# EAGLE design Clamp board - 2S-7.4-0V rev C1 (EAGLE 7.2.0)
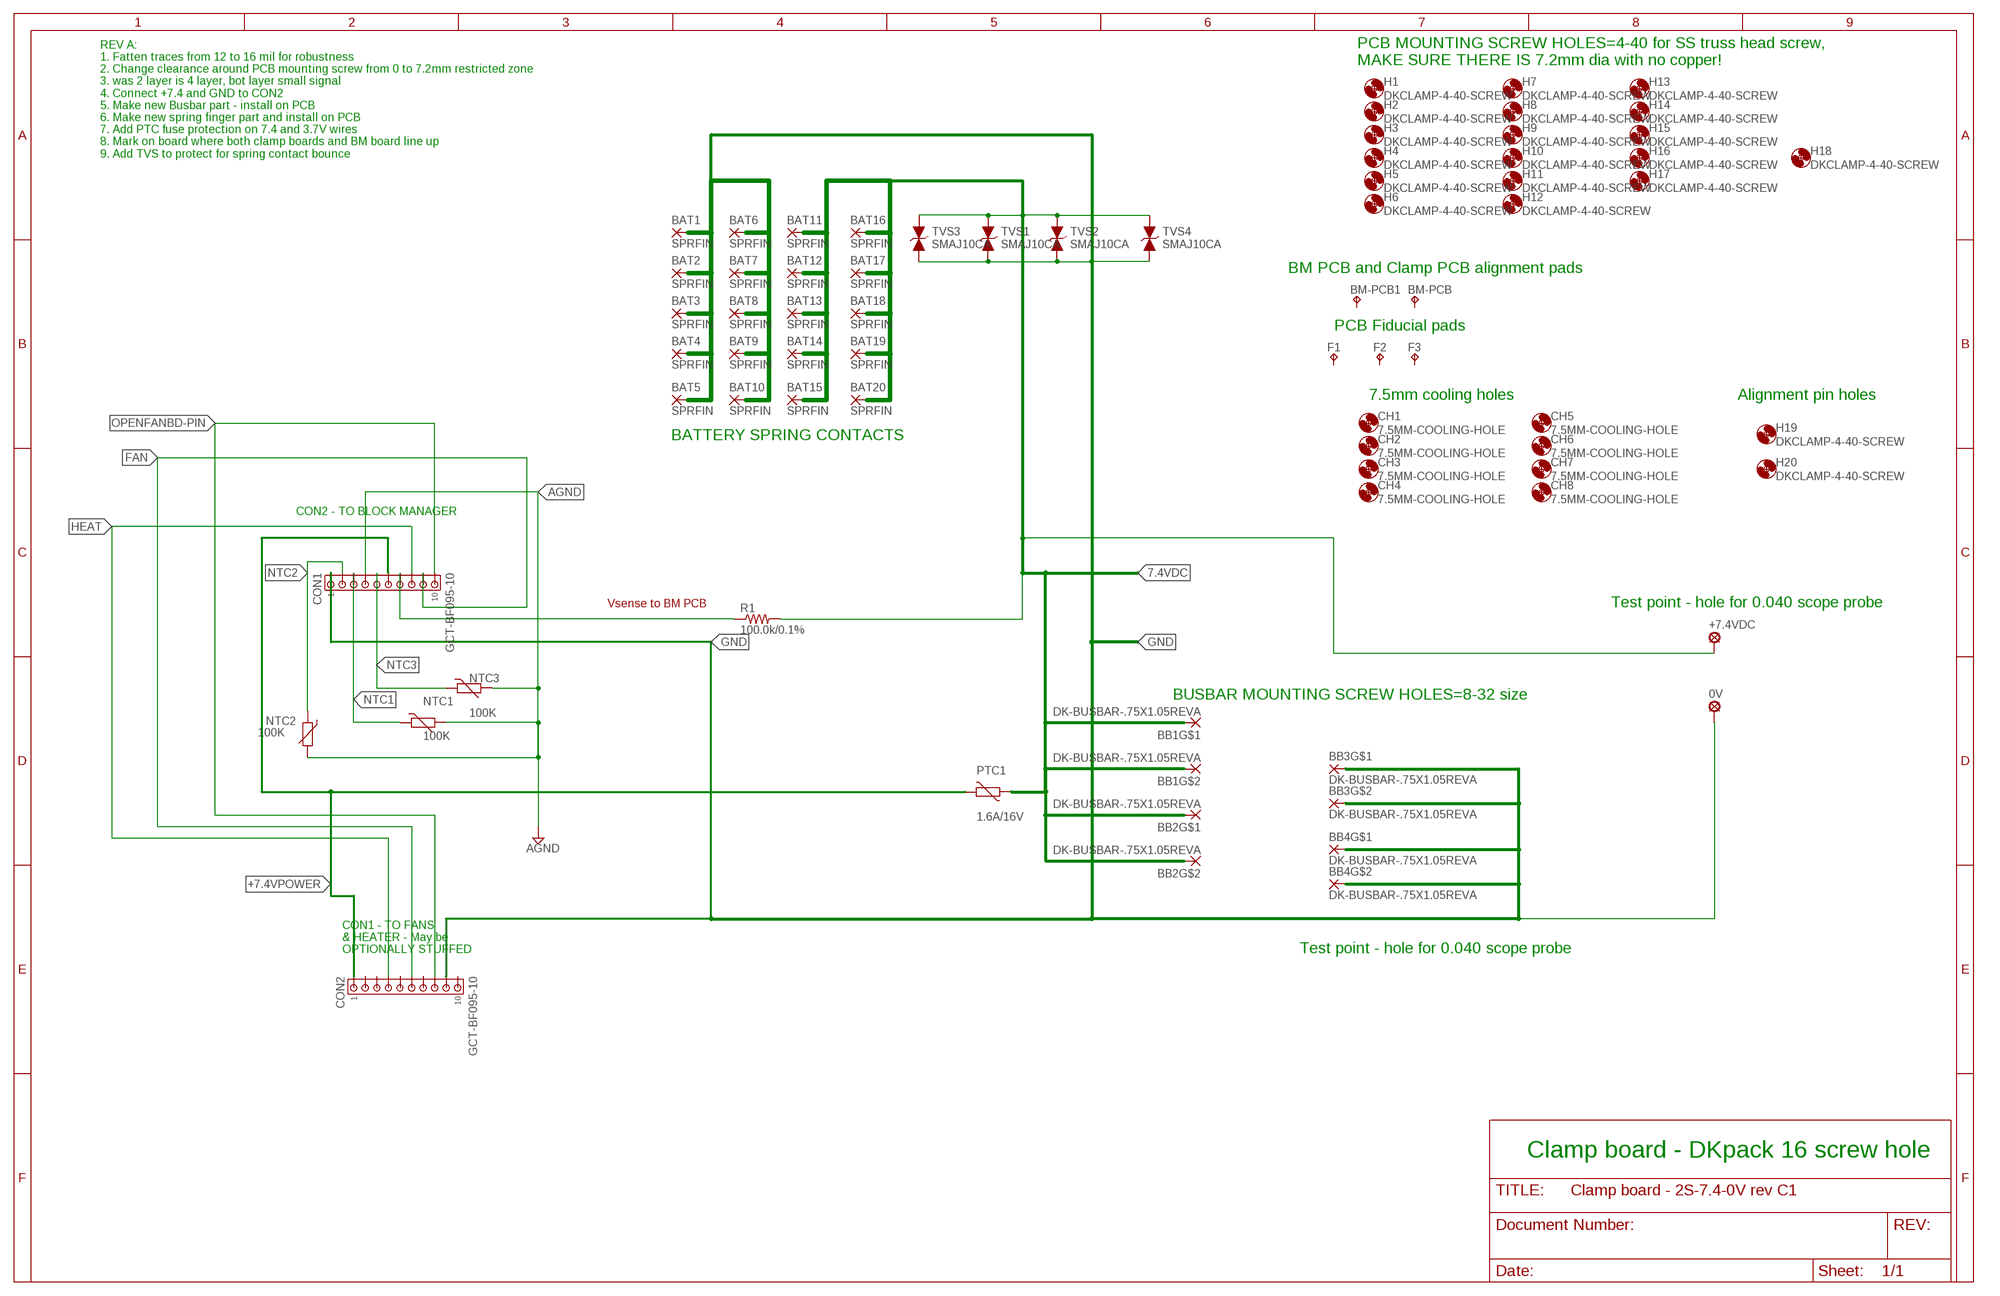
[diagram p0: schematic, sheet 1]

## Parts
0V  LSP10  [LSP10]
+7.4VDC  LSP10  [LSP10]
BAT1  SPRFIN  DK-SPRING-REV2  [DK-SPRING-FINGER-REV2]
BAT2  SPRFIN  DK-SPRING-REV2  [DK-SPRING-FINGER-REV2]
BAT3  SPRFIN  DK-SPRING-REV2  [DK-SPRING-FINGER-REV2]
BAT4  SPRFIN  DK-SPRING-REV2  [DK-SPRING-FINGER-REV2]
BAT5  SPRFIN  DK-SPRING-REV2  [DK-SPRING-FINGER-REV2]
BAT6  SPRFIN  DK-SPRING-REV2  [DK-SPRING-FINGER-REV2]
BAT7  SPRFIN  DK-SPRING-REV2  [DK-SPRING-FINGER-REV2]
BAT8  SPRFIN  DK-SPRING-REV2  [DK-SPRING-FINGER-REV2]
BAT9  SPRFIN  DK-SPRING-REV2  [DK-SPRING-FINGER-REV2]
BAT10  SPRFIN  DK-SPRING-REV2  [DK-SPRING-FINGER-REV2]
BAT11  SPRFIN  DK-SPRING-REV2  [DK-SPRING-FINGER-REV2]
BAT12  SPRFIN  DK-SPRING-REV2  [DK-SPRING-FINGER-REV2]
BAT13  SPRFIN  DK-SPRING-REV2  [DK-SPRING-FINGER-REV2]
BAT14  SPRFIN  DK-SPRING-REV2  [DK-SPRING-FINGER-REV2]
BAT15  SPRFIN  DK-SPRING-REV2  [DK-SPRING-FINGER-REV2]
BAT16  SPRFIN  DK-SPRING-REV2  [DK-SPRING-FINGER-REV2]
BAT17  SPRFIN  DK-SPRING-REV2  [DK-SPRING-FINGER-REV2]
BAT18  SPRFIN  DK-SPRING-REV2  [DK-SPRING-FINGER-REV2]
BAT19  SPRFIN  DK-SPRING-REV2  [DK-SPRING-FINGER-REV2]
BAT20  SPRFIN  DK-SPRING-REV2  [DK-SPRING-FINGER-REV2]
BB1  DK-BUSBAR-.75X1.05REVA  [DKBUSBAR]
BB2  DK-BUSBAR-.75X1.05REVA  [DKBUSBAR]
BB3  DK-BUSBAR-.75X1.05REVA  [DKBUSBAR]
BB4  DK-BUSBAR-.75X1.05REVA  [DKBUSBAR]
BM-PCB  FIDUCIALTP15SQ  [TP15SQ]
BM-PCB1  FIDUCIALTP15SQ  [TP15SQ]
CH1  7.5MM-COOLING-HOLE  [7.5MM-COOLING-HOLE]
CH2  7.5MM-COOLING-HOLE  [7.5MM-COOLING-HOLE]
CH3  7.5MM-COOLING-HOLE  [7.5MM-COOLING-HOLE]
CH4  7.5MM-COOLING-HOLE  [7.5MM-COOLING-HOLE]
CH5  7.5MM-COOLING-HOLE  [7.5MM-COOLING-HOLE]
CH6  7.5MM-COOLING-HOLE  [7.5MM-COOLING-HOLE]
CH7  7.5MM-COOLING-HOLE  [7.5MM-COOLING-HOLE]
CH8  7.5MM-COOLING-HOLE  [7.5MM-COOLING-HOLE]
CON1  GCT-BF095-10  [GCT-BF085-10]
CON2  GCT-BF095-10  [GCT-BF085-10]
F1  FIDUCIALB1,27  [B1,27]
F2  FIDUCIALB1,27  [B1,27]
F3  FIDUCIALB1,27  [B1,27]
H1  DKCLAMP-4-40-SCREW  [2.95MM-HOLE-FOR-4-40SCREW-DKCLAMP]
H2  DKCLAMP-4-40-SCREW  [2.95MM-HOLE-FOR-4-40SCREW-DKCLAMP]
H3  DKCLAMP-4-40-SCREW  [2.95MM-HOLE-FOR-4-40SCREW-DKCLAMP]
H4  DKCLAMP-4-40-SCREW  [2.95MM-HOLE-FOR-4-40SCREW-DKCLAMP]
H5  DKCLAMP-4-40-SCREW  [2.95MM-HOLE-FOR-4-40SCREW-DKCLAMP]
H6  DKCLAMP-4-40-SCREW  [2.95MM-HOLE-FOR-4-40SCREW-DKCLAMP]
H7  DKCLAMP-4-40-SCREW  [2.95MM-HOLE-FOR-4-40SCREW-DKCLAMP]
H8  DKCLAMP-4-40-SCREW  [2.95MM-HOLE-FOR-4-40SCREW-DKCLAMP]
H9  DKCLAMP-4-40-SCREW  [2.95MM-HOLE-FOR-4-40SCREW-DKCLAMP]
H10  DKCLAMP-4-40-SCREW  [2.95MM-HOLE-FOR-4-40SCREW-DKCLAMP]
H11  DKCLAMP-4-40-SCREW  [2.95MM-HOLE-FOR-4-40SCREW-DKCLAMP]
H12  DKCLAMP-4-40-SCREW  [2.95MM-HOLE-FOR-4-40SCREW-DKCLAMP]
H13  DKCLAMP-4-40-SCREW  [2.95MM-HOLE-FOR-4-40SCREW-DKCLAMP]
H14  DKCLAMP-4-40-SCREW  [2.95MM-HOLE-FOR-4-40SCREW-DKCLAMP]
H15  DKCLAMP-4-40-SCREW  [2.95MM-HOLE-FOR-4-40SCREW-DKCLAMP]
H16  DKCLAMP-4-40-SCREW  [2.95MM-HOLE-FOR-4-40SCREW-DKCLAMP]
H17  DKCLAMP-4-40-SCREW  [2.95MM-HOLE-FOR-4-40SCREW-DKCLAMP]
H18  DKCLAMP-4-40-SCREW  [2.95MM-HOLE-FOR-4-40SCREW-DKCLAMP]
H19  DKCLAMP-4-40-SCREW  [2.95MM-HOLE-FOR-4-40SCREW-DKCLAMP]
H20  DKCLAMP-4-40-SCREW  [2.95MM-HOLE-FOR-4-40SCREW-DKCLAMP]
NTC1  100K  NTC-MURATA-NCP18WF104J03RB  [0603]
NTC2  100K  NTC-MURATA-NCP18WF104J03RB  [0603]
NTC3  100K  NTC-MURATA-NCP18WF104J03RB  [0603]
PTC1  1.6A/16V  VARISTORCN1812  [CT/CN1812]
R1  100.0k/0.1%  R-US_R0603  [R0603]
TVS1  SMAJ10CA  TVS-SMA  [SMAJ]
TVS2  SMAJ10CA  TVS-SMA  [SMAJ]
TVS3  SMAJ10CA  TVS-SMA  [SMAJ]
TVS4  SMAJ10CA  TVS-SMA  [SMAJ]

## Nets
7.4VDC: +7.4VDC.MP BAT11.2(P) BAT12.2(P) BAT13.2(P) BAT14.2(P) BAT15.2(P) BAT16.2(P) BAT17.2(P) BAT18.2(P) BAT19.2(P) BAT20.2(P) BB1.P$2 BB1.P$3 BB2.P$2 BB2.P$3 PTC1.1 R1.2 TVS1.K(C) TVS2.K(C) TVS3.K(C) TVS4.K(C)
7.4VSCALED: CON1.P$7 R1.1
+7.4VPOWER: CON1.P$6 CON2.P$1 PTC1.2
AGND: CON1.P$4 NTC1.2 NTC2.2 NTC3.2
FAN: CON1.P$9 CON2.P$6
GND: 0V.MP BAT1.2(P) BAT2.2(P) BAT3.2(P) BAT4.2(P) BAT5.2(P) BAT6.2(P) BAT7.2(P) BAT8.2(P) BAT9.2(P) BAT10.2(P) BB3.P$2 BB3.P$3 BB4.P$2 BB4.P$3 CON1.P$1 CON2.P$9 TVS1.A TVS2.A TVS3.A TVS4.A
HEAT: CON1.P$8 CON2.P$4
NTC1: CON1.P$3 NTC1.1
NTC2: CON1.P$2 NTC2.1
NTC3: CON1.P$5 NTC3.1
OPENFANBD-PIN: CON1.P$10 CON2.P$8
Unconnected: BM-PCB1.TP BM-PCB.TP CON2.P$2 CON2.P$3 CON2.P$5 CON2.P$7 CON2.P$10 F1.PP(TP) F2.PP(TP) F3.PP(TP)

## Notes on the sheet
- PCB MOUNTING SCREW HOLES=4-40 for SS truss head screw,
  MAKE SURE THERE IS 7.2mm dia with no copper!
- REV A:
  1. Fatten traces from 12 to 16 mil for robustness
  2. Change clearance around PCB mounting screw from 0 to 7.2mm restricted zone
  3. was 2 layer is 4 layer, bot layer small signal
  4. Connect +7.4 and GND to CON2
  5. Make new Busbar part - install on PCB
  6. Make new spring finger part and install on PCB
  7. Add PTC fuse protection on 7.4 and 3.7V wires
  8. Mark on board where both clamp boards and BM board line up
  9. Add TVS to protect for spring contact bounce
- BM PCB and Clamp PCB alignment pads
- PCB Fiducial pads
- 7.5mm cooling holes | Alignment pin holes
- BATTERY SPRING CONTACTS
- CON2 - TO BLOCK MANAGER
- Vsense to BM PCB | Test point - hole for 0.040 scope probe
- BUSBAR MOUNTING SCREW HOLES=8-32 size
- CON1 - TO FANS
  & HEATER - May be 
  OPTIONALLY STUFFED
- Test point - hole for 0.040 scope probe
- Clamp board - DKpack 16 screw hole

## Library data of the parts
0V +7.4VDC = solpad:LSP10: SOLDER PAD drill 1.0 mm, distributor Buerklin, 12H555
BAT1 = Power_board - Copy:DK-SPRING-REV2; 100PCPRICE: .259; MPN: Keystone 109-2
BAT2-BAT20 = Power_board - Copy:DK-SPRING-REV2
BB1-BB4 = Power_board - Copy:DK-BUSBAR-.75X1.05REVA: DK copper busbar for connecting DK blocks, size is .75 in by 1.05 in by 1/8in thick. Takes two 8-32 brass screws into each DK block
BM-PCB BM-PCB1 F1-F3 = offgrid testpad:FIDUCIAL: Fiducial pad - B1,27
CH1-CH8 = offgrid holes:7.5MM-COOLING-HOLE: Cooling hole 7.5mm or .295in hole
CON1 CON2 = offgrid con-amp:GCT-BF095-10: GCT Bf095 series 2.00mm 2mm socket single row through hole vertical THP
H1-H20 = offgrid holes:DKCLAMP-4-40-SCREW: DKclamp screw hole of 2.95mm and keepout of .130rad or .260 head diameter Use 4-40 screw with truss head for clamp board
NTC1-NTC3 = offgrid varistor:NTC-MURATA-NCP18WF104J03RB: Murata NCP18WF104J03RB 100K NTC 5%; 100PCPRICE: .106; 1KPRICE: .07999; MPN: MURATA NCP18WF104J03RB
PTC1 = offgrid varistor:VARISTOR: VARISTOR; 100PCPRICE: .13; 1KPRICE: .09; MPN: Bel 0ZCG0160BF2C
R1 = offgrid resistor:R-US_: RESISTOR, American symbol
TVS1-TVS4 = offgrid diode:TVS-SMA: TVS diode in SMA package - bidirectional type - SMAJXXCA type; 100PCPRICE: .105; 1KPRICE: .081; MPN: ST SMAJ10CA-TR

## Board
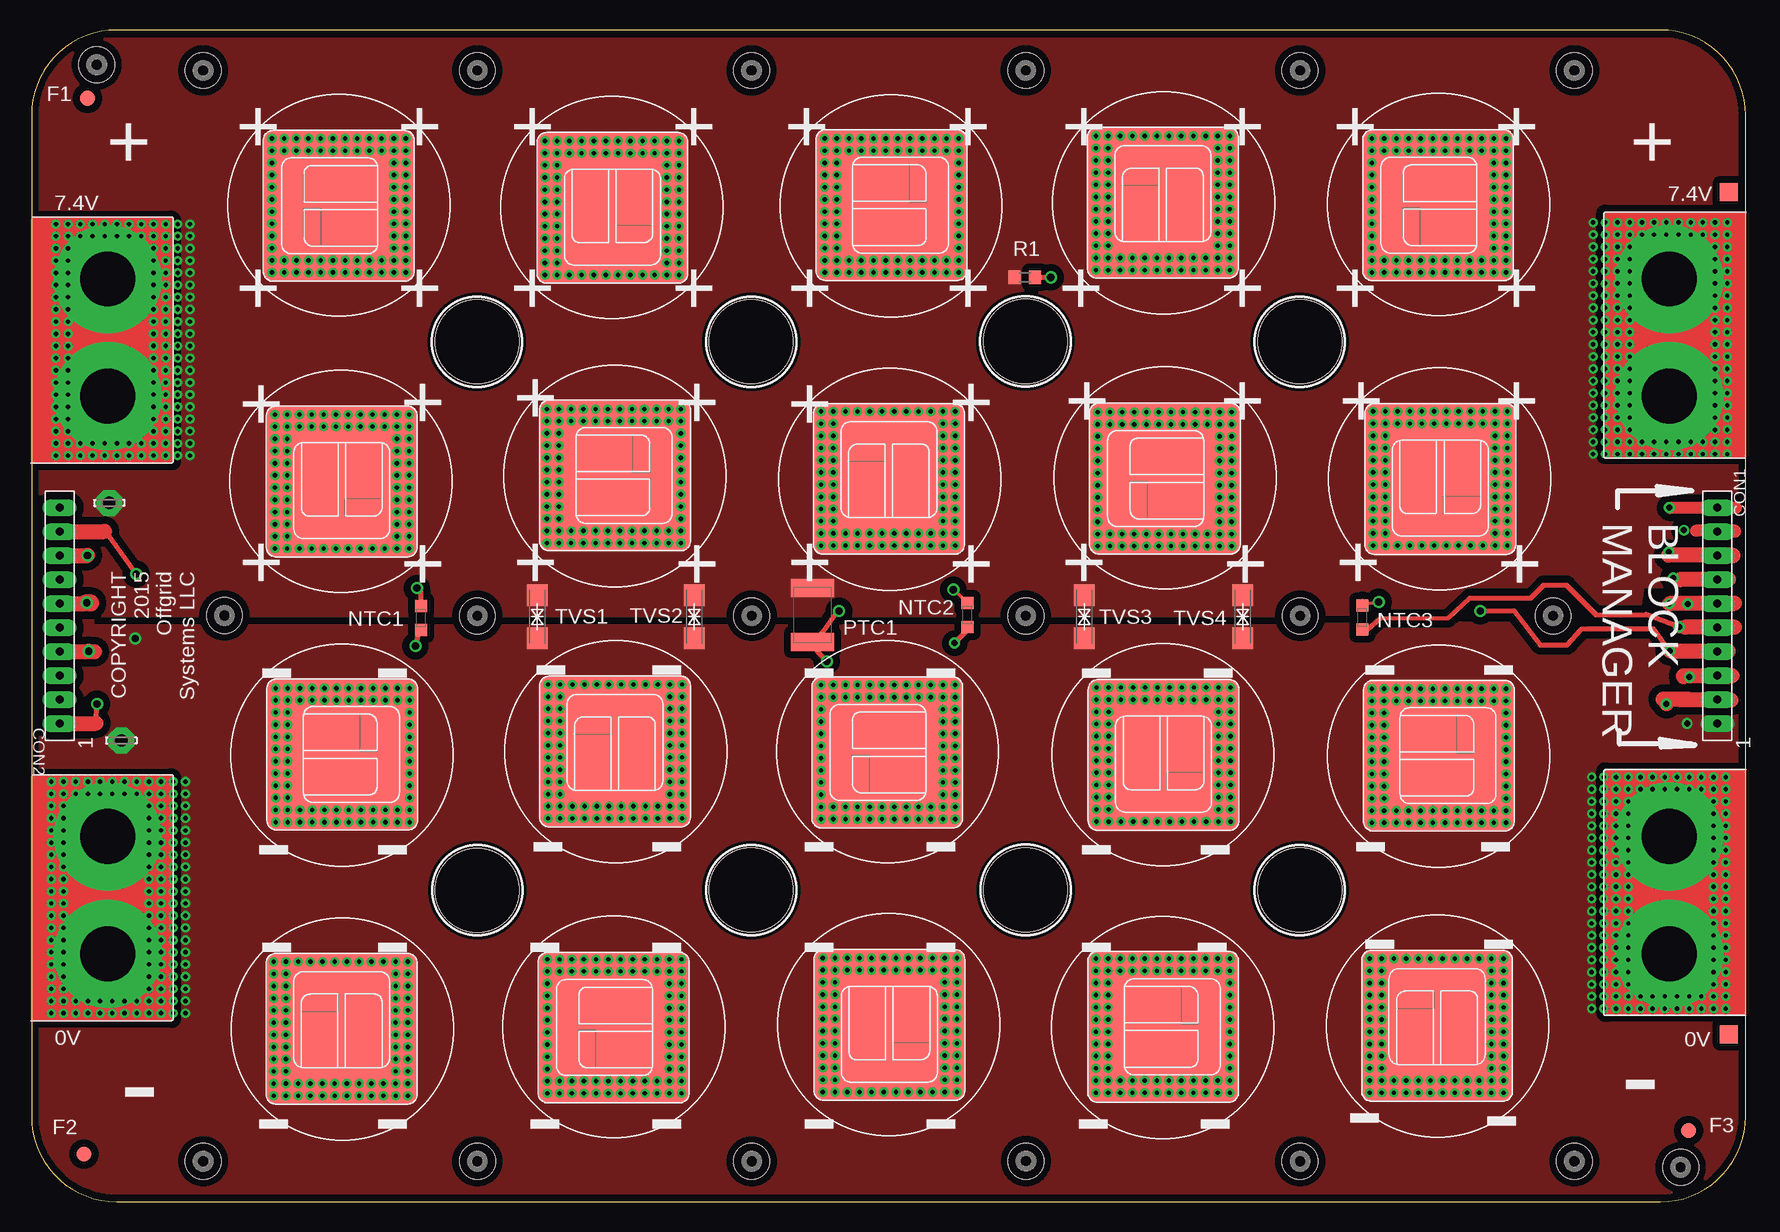
[diagram p1: board, top side]
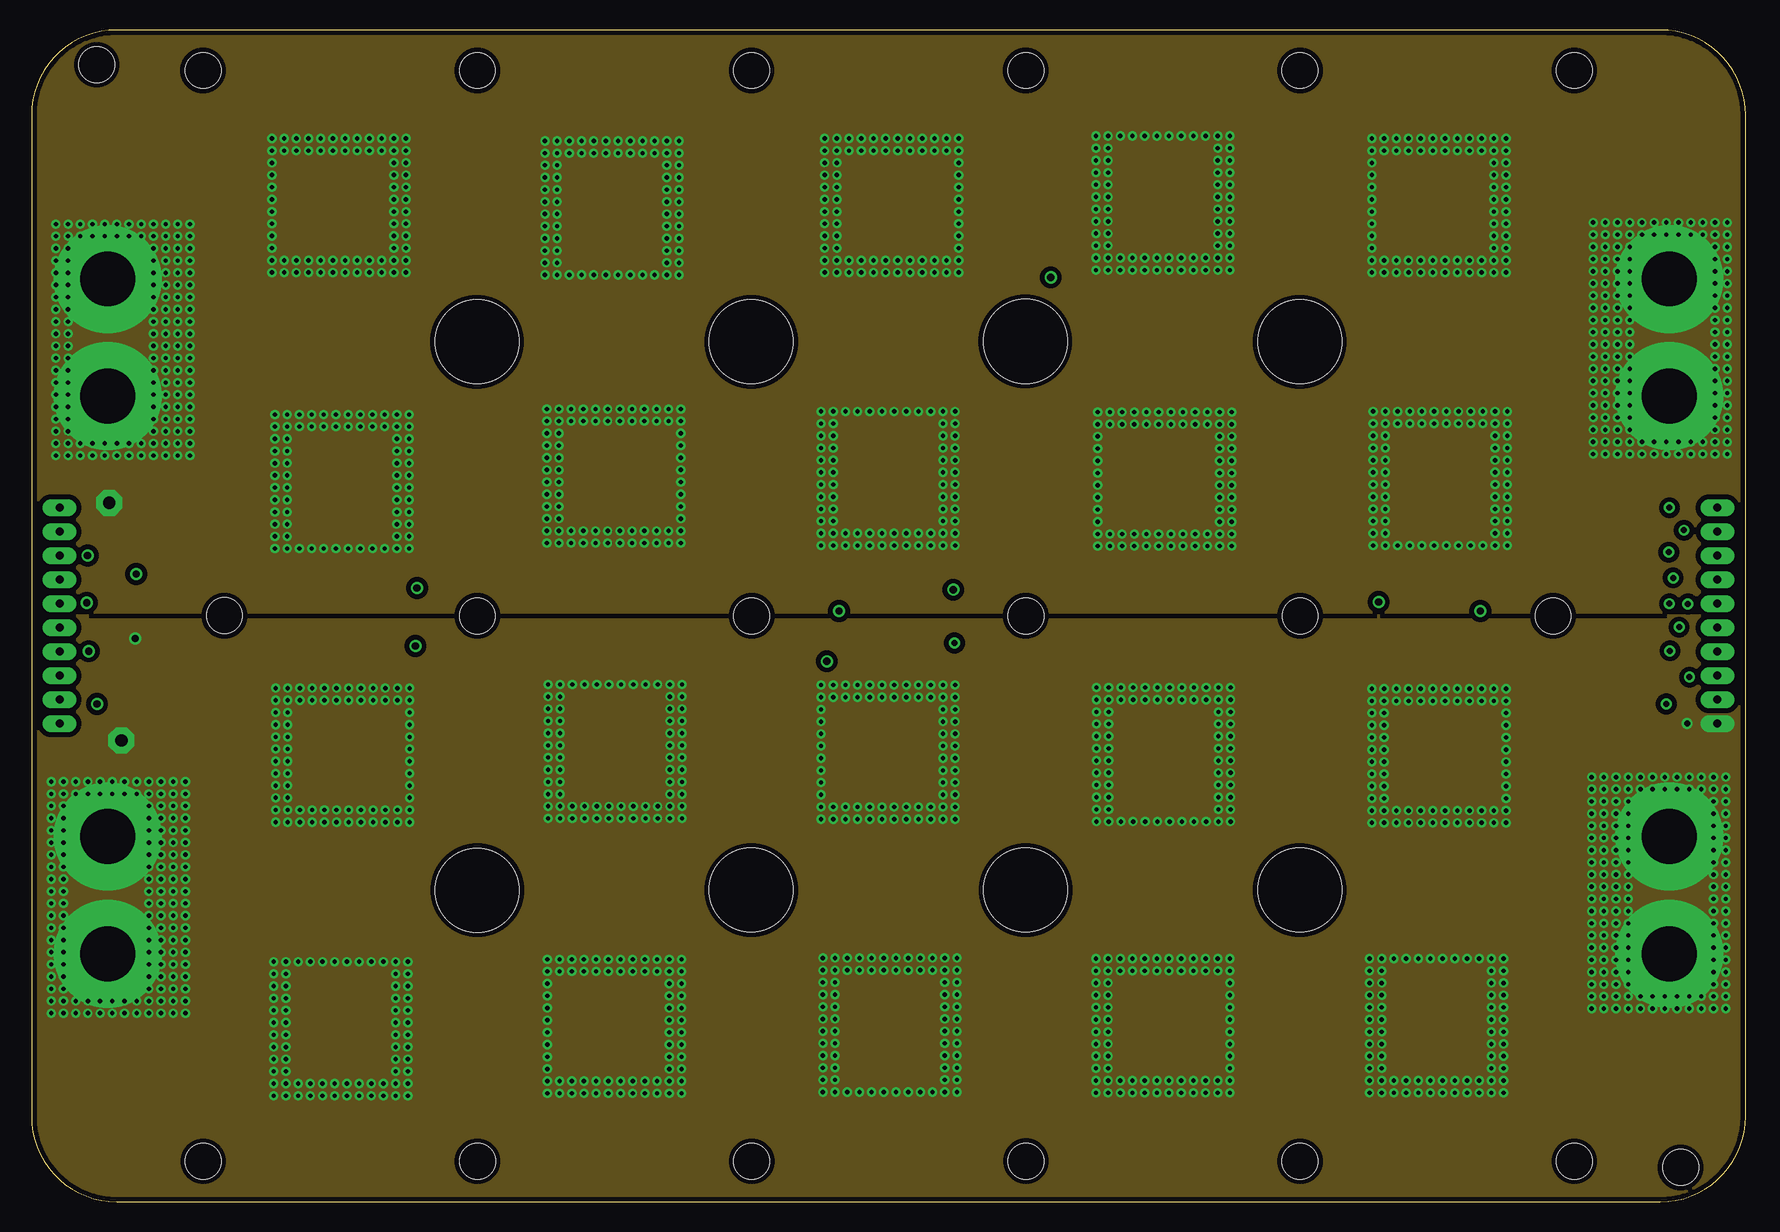
[diagram p2: board, inner layer InsideTop]
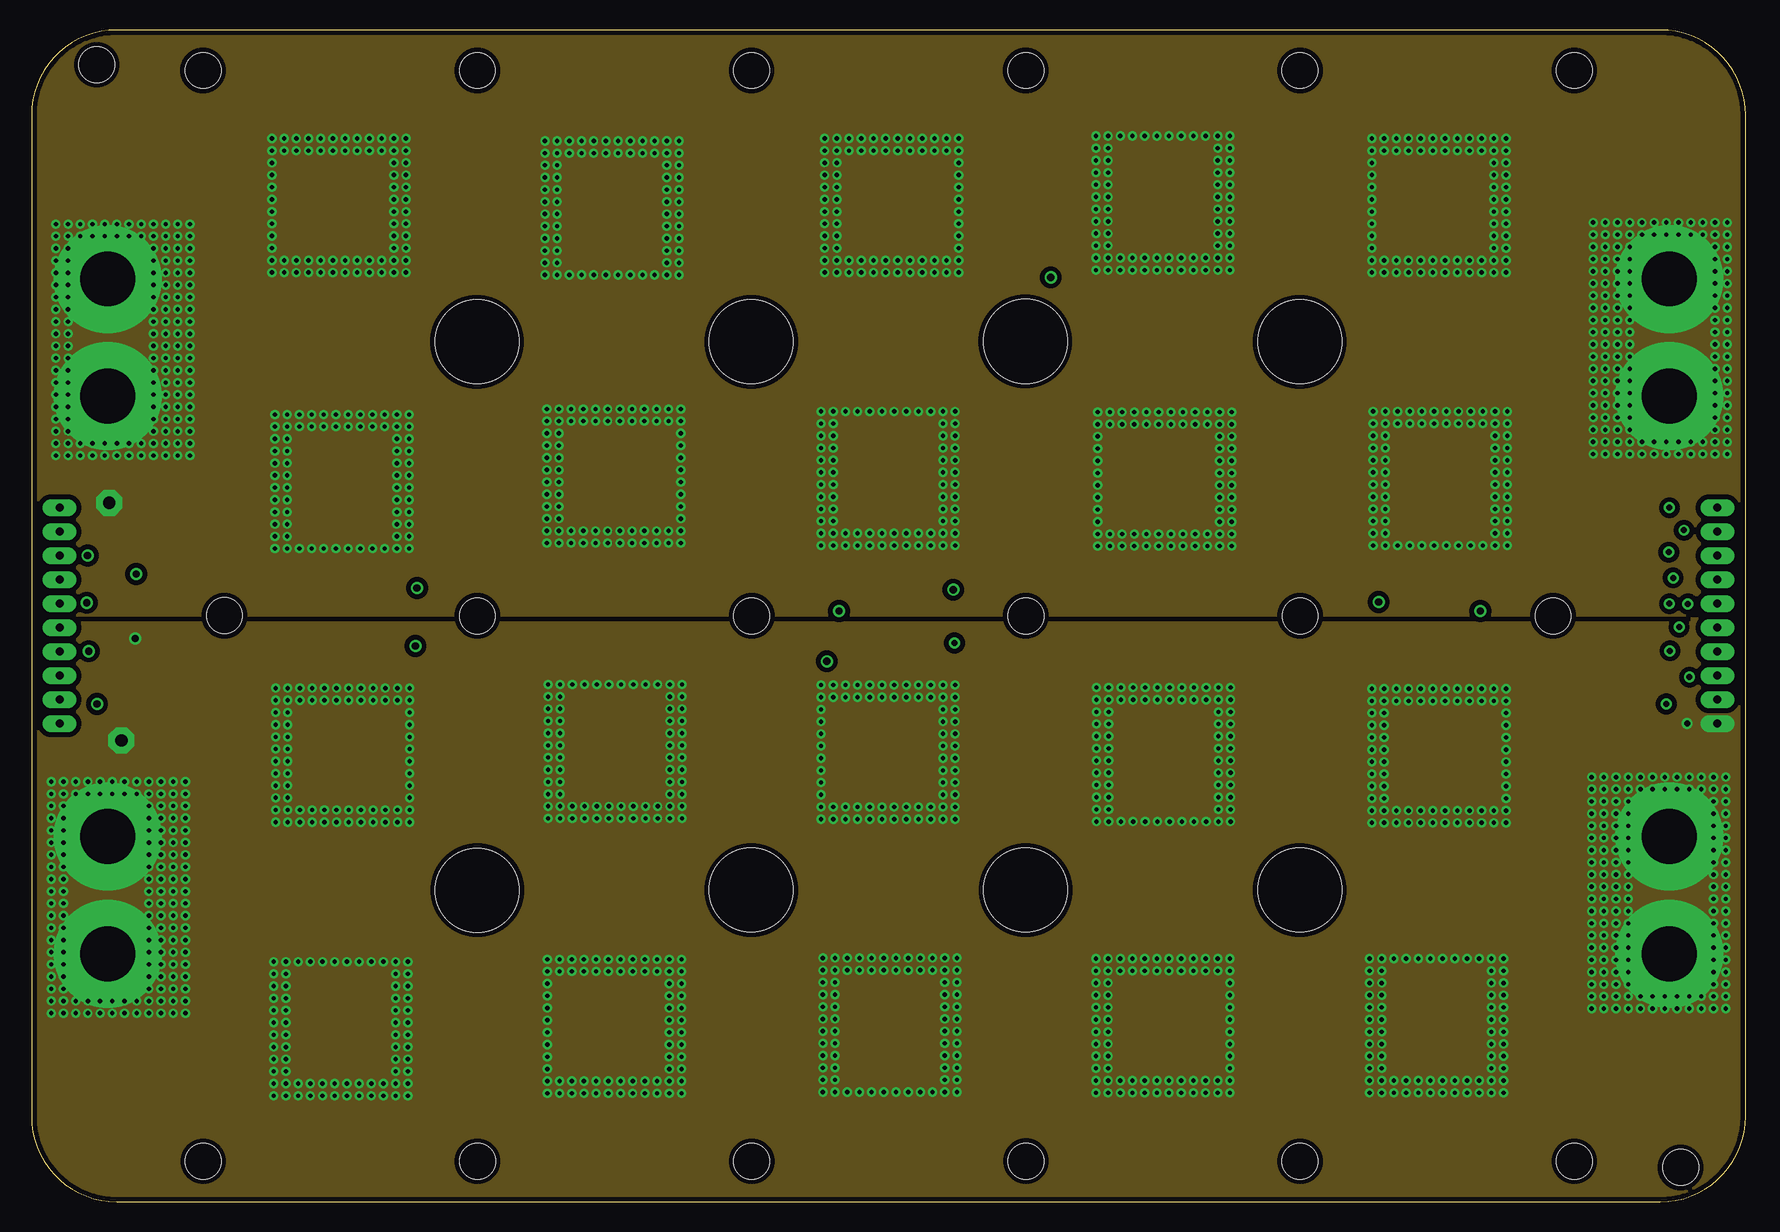
[diagram p3: board, inner layer InsideBot]
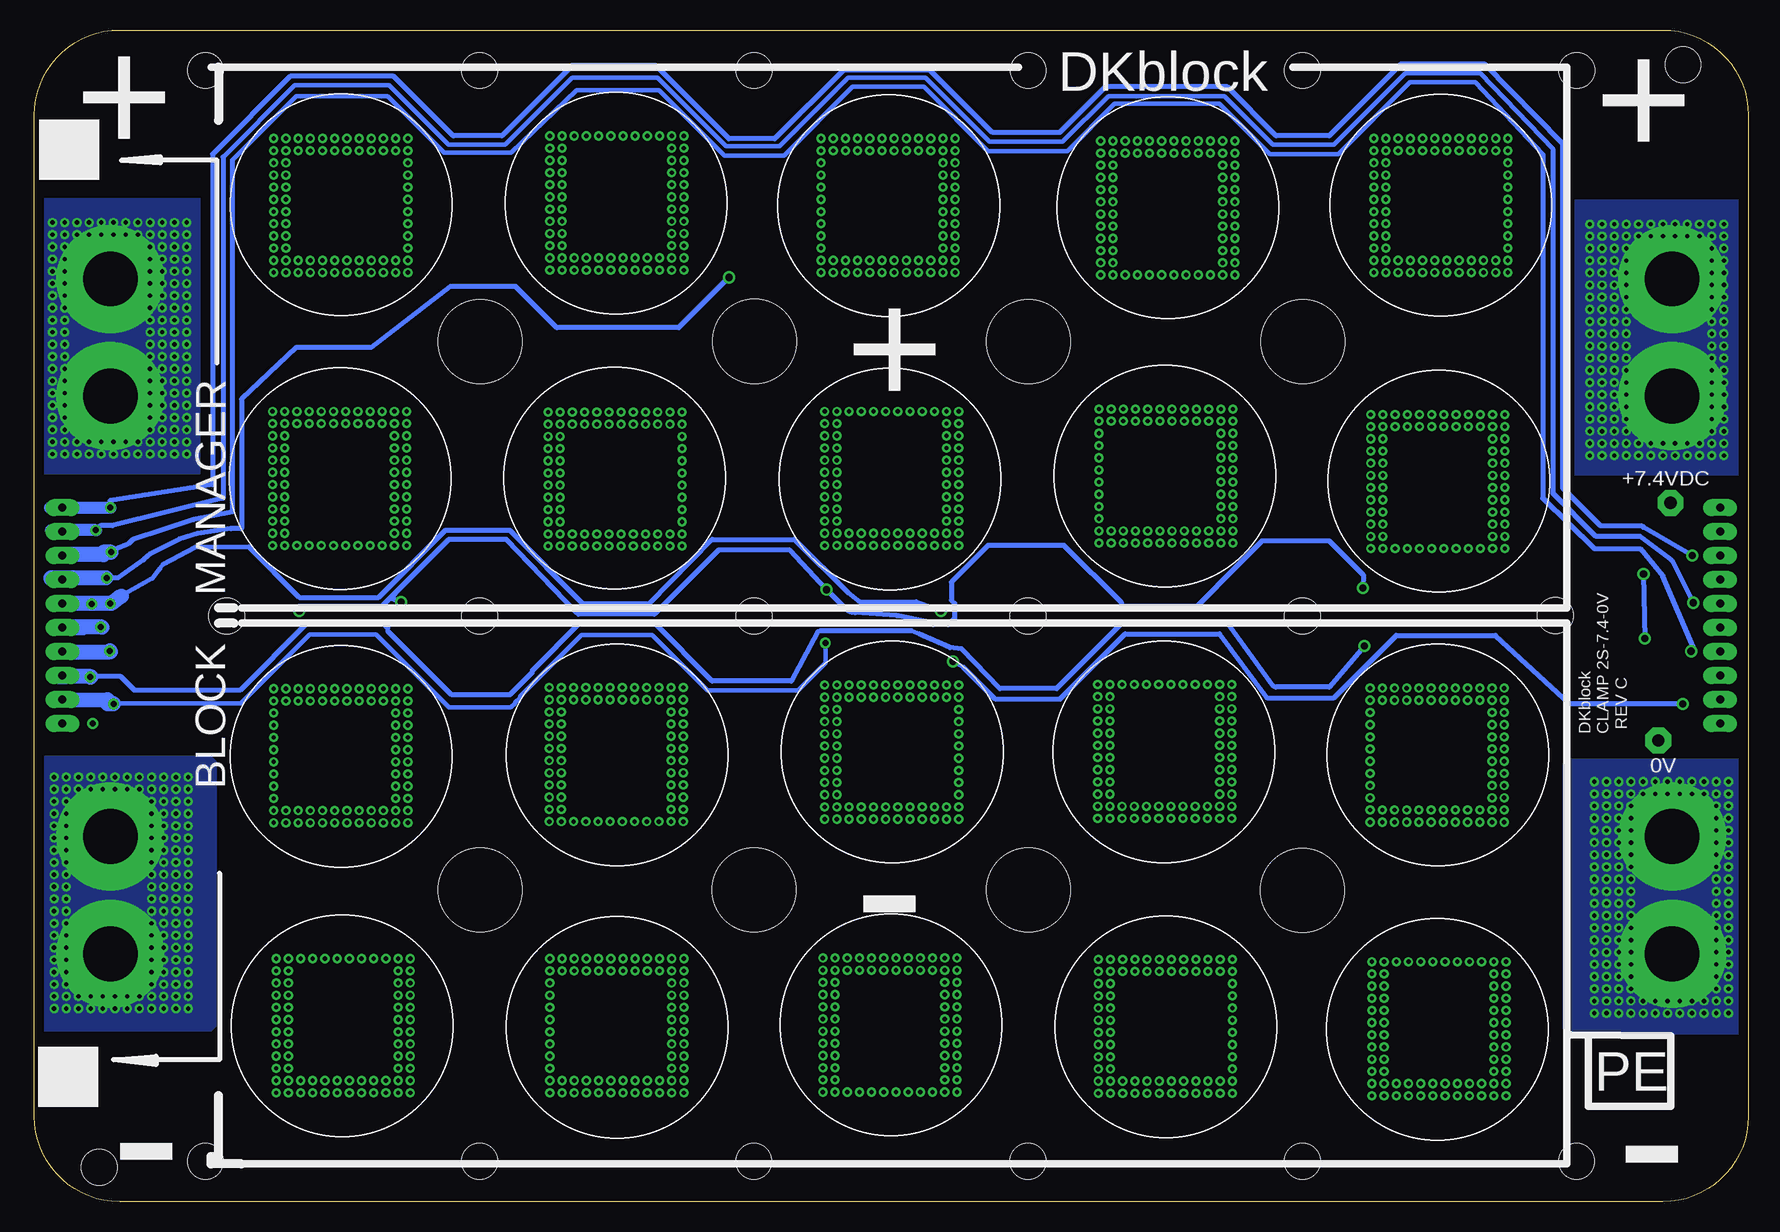
[diagram p4: board, bottom side, seen from below]

Size 142.88 x 97.69 mm. Coordinates in mm from the lower left corner, seen from the top.
Outline: 7.11,0 135.76,0 arc90 142.88,7.11 142.88,90.58 arc90 135.76,97.69 7.11,97.69 arc90 0,90.58 0,7.11 arc90 7.11,0
Copper layers ((1*2)+(3*16)): Top 0.035mm / dielectric 1.5mm / InsideTop 0.035mm / dielectric 0.15mm / InsideBot 0.035mm / dielectric 0.2mm / Bottom 0.035mm
Design rules "Offgrid design rules clamp boards 4 layer *": minimum track width 10mil, minimum drill 14mil, track to track 8mil, track to pad 8mil, pad to pad 8mil, via to via 8mil, smd to smd 0mil, copper to edge 10mil, drill to drill 5mil, minimum pad ring 10mil, minimum via ring 8mil, stop-mask expansion 4mil, vias tented up to drill 30mil, thermal gap 10mil

### Footprints (pad centres in the part's own frame; a part is rotated, then mirrored left to right if it is on the bottom)
LSP10 = drill 1.016 pad 2.159 octagon: MP 0,0
DK-SPRING-FINGER-REV2 = smd 12.573 x 12.573: 2 0,0.051
DKBUSBAR = drill 4.572 pad 9: P$2 1.397,-4.889; P$3 1.397,4.889
TP15SQ = smd 1.5 x 1.5: TP 0,0
7.5MM-COOLING-HOLE = hole 6.985: 0,0
GCT-BF085-10 = drill 0.66 pad 1.422 long: P$1 9,0; P$2 7,0; P$3 5,0; P$4 3,0; P$5 1,0; P$6 -1,0; P$7 -3,0; P$8 -5,0; P$9 -7,0; P$10 -9,0
B1,27 = smd 1.27 x 1.27: PP 0,0
2.95MM-HOLE-FOR-4-40SCREW-DKCLAMP = hole 2.972: 0,0
0603 = smd 1 x 1: 1 -1,0; 2 1,0
CT/CN1812 = smd 1.5 x 3.6: 1 -2.25,0; 2 2.25,0
R0603 = smd 1 x 1.1: 1 -0.85,0; 2 0.85,0
SMAJ = smd 1.8 x 1.7: A -1.898,0; K 1.694,0

### Placement (x,y rotation side)
0V  7.49,38.46 0 top
+7.4VDC  6.48,58.27 0 top
BAT1  117.29,37.13 0 top
BAT2  48.69,37.51 90 top
BAT3  94.31,37.27 270 top
BAT4  117.22,14.65 90 top
BAT5  71.45,14.76 270 top
BAT6  94.3,14.53 0 top
BAT7  48.55,14.58 180 top
BAT8  71.35,37.52 180 top
BAT9  25.91,14.4 90 top
BAT10  25.88,37.23 0 top
BAT11  48.61,60.5 0 top
BAT12  71.65,83.03 0 top
BAT13  25.8,60.08 270 top
BAT14  71.53,60.24 90 top
BAT15  48.36,82.89 270 top
BAT16  117.37,60.28 270 top
BAT17  94.49,60.35 180 top
BAT18  25.63,83.09 180 top
BAT19  117.28,83.14 180 top
BAT20  94.36,83.25 90 top
BB1  4.95,72.05 0 top
BB2  137.92,72.05 180 top
BB3  4.95,25.57 0 top
BB4  137.92,25.57 180 top
BM-PCB  141.48,84.18 0 top
BM-PCB1  141.48,13.94 0 top
CH1  37.12,71.7 0 top
CH2  59.99,71.7 0 top
CH3  82.85,71.73 0 top
CH4  105.71,71.7 0 top
CH5  37.15,25.98 0 top
CH6  59.99,25.99 0 top
CH7  82.86,25.99 0 top
CH8  105.71,25.99 0 top
CON1  140.53,48.87 270 top
CON2  2.35,48.87 270 top
F1  4.65,92 0 top
F2  4.38,3.97 0 top
F3  138.13,5.95 0 top
H1  14.31,94.31 0 top
H2  37.16,94.31 0 top
H3  60.02,94.31 0 top
H4  82.88,94.31 0 top
H5  105.74,94.31 0 top
H6  128.6,94.31 0 top
H7  37.16,48.84 0 top
H8  60.03,48.84 0 top
H9  82.88,48.84 0 top
H10  105.75,48.84 0 top
H11  14.31,3.38 0 top
H12  37.17,3.38 0 top
H13  60.03,3.38 0 top
H14  82.89,3.39 0 top
H15  105.74,3.38 0 top
H16  128.6,3.38 0 top
H17  16.08,48.87 0 top
H18  126.83,48.84 0 top
H19  5.44,94.79 0 top
H20  137.46,2.87 0 top
NTC1  32.46,48.67 90 top
NTC2  78,48.92 90 top
NTC3  110.92,48.72 90 top
PTC1  65.1,48.92 270 top
R1  82.8,77.06 180 top
TVS1  42.16,48.87 90 top
TVS2  55.24,48.87 90 top
TVS3  87.76,48.87 90 top
TVS4  100.97,48.87 90 top

### Tracks (layer width: path | path; a pad name or v marks a point on that pad's centre or on a via)
7.4VDC  (via drill 0.36)
  other vias: 31.22,77.47 30.2,77.47 29.18,77.47 28.17,77.47 27.15,77.47 26.14,77.47 25.12,77.47 24.1,77.47 23.09,77.47 22.07,77.47 21.06,77.47 20.04,77.47 20.04,78.49 20.04,79.5 20.04,80.52 20.04,81.53 20.04,82.55 20.04,83.57 20.04,84.58 20.04,85.6 20.04,86.61 20.04,87.63 20.04,88.65 31.22,78.49 30.2,78.49 29.18,78.49 28.17,78.49 27.15,78.49 26.14,78.49 25.12,78.49 24.1,78.49 23.09,78.49 22.07,78.49 21.06,78.49 31.22,79.5 30.2,79.5 31.22,80.52 30.2,80.52 31.22,81.53 30.2,81.53 30.2,82.55 31.22,83.57 30.2,83.57 31.22,84.58 30.2,84.58 31.22,85.6 30.2,85.6 31.22,86.61 30.2,86.61 30.2,87.63 31.22,87.63 31.22,88.65 30.2,88.65 29.18,88.65 29.18,87.63 28.17,87.63 27.15,87.63 26.14,87.63 25.12,87.63 24.1,87.63 23.09,87.63 22.07,87.63 21.06,87.63 21.06,88.65 22.07,88.65 23.09,88.65 24.1,88.65 25.12,88.65 26.14,88.65 27.15,88.65 28.17,88.65 31.22,82.55 53.98,88.44 53.98,87.43 53.98,86.41 53.98,85.39 53.98,84.38 53.98,83.36 53.98,82.35 53.98,81.33 53.98,80.31 53.98,79.3 53.98,78.28 53.98,77.27 52.96,77.27 51.94,77.27 50.93,77.27 49.91,77.27 48.9,77.27 47.88,77.27 46.86,77.27 45.85,77.27 44.83,77.27 43.82,77.27 42.8,77.27 52.96,88.44 52.96,87.43 52.96,86.41 52.96,85.39 52.96,84.38 52.96,83.36 52.96,82.35 52.96,81.33 52.96,80.31 52.96,79.3 52.96,78.28 51.94,88.44 51.94,87.43 50.93,88.44 50.93,87.43 49.91,88.44 49.91,87.43 48.9,87.43 47.88,88.44 47.88,87.43 46.86,88.44 46.86,87.43 45.85,88.44 45.85,87.43 44.83,88.44 44.83,87.43 43.82,87.43 43.82,88.44 42.8,88.44 42.8,87.43 42.8,86.41 43.82,86.41 43.82,85.39 43.82,84.38 43.82,83.36 43.82,82.35 43.82,81.33 43.82,80.31 43.82,79.3 43.82,78.28 42.8,78.28 42.8,79.3 42.8,80.31 42.8,81.33 42.8,82.35 42.8,83.36 42.8,84.38 42.8,85.39 48.9,88.44 66.12,88.65 67.13,88.65 68.15,88.65 69.16,88.65 70.18,88.65 71.2,88.65 72.21,88.65 73.23,88.65 74.24,88.65 75.26,88.65 76.28,88.65 77.29,88.65 77.29,87.63 77.29,86.61 77.29,85.6 77.29,84.58 77.29,83.57 77.29,82.55 77.29,81.53 77.29,80.52 77.29,79.5 77.29,78.49 77.29,77.47 66.12,87.63 67.13,87.63 68.15,87.63 69.16,87.63 70.18,87.63 71.2,87.63 72.21,87.63 73.23,87.63 74.24,87.63 75.26,87.63 76.28,87.63 66.12,86.61 67.13,86.61 66.12,85.6 67.13,85.6 66.12,84.58 67.13,84.58 67.13,83.57 66.12,82.55 67.13,82.55 66.12,81.53 67.13,81.53 66.12,80.52 67.13,80.52 66.12,79.5 67.13,79.5 67.13,78.49 66.12,78.49 66.12,77.47 67.13,77.47 68.15,77.47 68.15,78.49 69.16,78.49 70.18,78.49 71.2,78.49 72.21,78.49 73.23,78.49 74.24,78.49 75.26,78.49 76.28,78.49 76.28,77.47 75.26,77.47 74.24,77.47 73.23,77.47 72.21,77.47 71.2,77.47 70.18,77.47 69.16,77.47 66.12,83.57 88.72,77.67 88.72,78.69 88.72,79.71 88.72,80.72 88.72,81.74 88.72,82.75 88.72,83.77 88.72,84.79 88.72,85.8 88.72,86.82 88.72,87.83 88.72,88.85 89.74,88.85 90.75,88.85 91.77,88.85 92.79,88.85 93.8,88.85 94.82,88.85 95.83,88.85 96.85,88.85 97.87,88.85 98.88,88.85 99.9,88.85 89.74,77.67 89.74,78.69 89.74,79.71 89.74,80.72 89.74,81.74 89.74,82.75 89.74,83.77 89.74,84.79 89.74,85.8 89.74,86.82 89.74,87.83 90.75,77.67 90.75,78.69 91.77,77.67 91.77,78.69 92.79,77.67 92.79,78.69 93.8,78.69 94.82,77.67 94.82,78.69 95.83,77.67 95.83,78.69 96.85,77.67 96.85,78.69 97.87,77.67 97.87,78.69 98.88,78.69 98.88,77.67 99.9,77.67 99.9,78.69 99.9,79.71 98.88,79.71 98.88,80.72 98.88,81.74 98.88,82.75 98.88,83.77 98.88,84.79 98.88,85.8 98.88,86.82 98.88,87.83 99.9,87.83 99.9,86.82 99.9,85.8 99.9,84.79 99.9,83.77 99.9,82.75 99.9,81.74 99.9,80.72 93.8,77.67 123.01,65.89 123.01,64.87 123.01,63.86 123.01,62.84 123.01,61.82 123.01,60.81 123.01,59.79 123.01,58.78 123.01,57.76 123.01,56.74 123.01,55.73 123.01,54.71 122,54.71 120.98,54.71 119.96,54.71 118.95,54.71 117.93,54.71 116.92,54.71 115.9,54.71 114.88,54.71 113.87,54.71 112.85,54.71 111.84,54.71 122,65.89 122,64.87 122,63.86 122,62.84 122,61.82 122,60.81 122,59.79 122,58.78 122,57.76 122,56.74 122,55.73 120.98,65.89 120.98,64.87 119.96,65.89 119.96,64.87 118.95,65.89 118.95,64.87 117.93,64.87 116.92,65.89 116.92,64.87 115.9,65.89 115.9,64.87 114.88,65.89 114.88,64.87 113.87,65.89 113.87,64.87 112.85,64.87 112.85,65.89 111.84,65.89 111.84,64.87 111.84,63.86 112.85,63.86 112.85,62.84 112.85,61.82 112.85,60.81 112.85,59.79 112.85,58.78 112.85,57.76 112.85,56.74 112.85,55.73 111.84,55.73 111.84,56.74 111.84,57.76 111.84,58.78 111.84,59.79 111.84,60.81 111.84,61.82 111.84,62.84 117.93,65.89 65.81,54.71 65.81,55.73 65.81,56.74 65.81,57.76 65.81,58.78 65.81,59.79 65.81,60.81 65.81,61.82 65.81,62.84 65.81,63.86 65.81,64.87 65.81,65.89 66.83,65.89 67.84,65.89 68.86,65.89 69.88,65.89 70.89,65.89 71.91,65.89 72.92,65.89 73.94,65.89 74.96,65.89 75.97,65.89 76.99,65.89 66.83,54.71 66.83,55.73 66.83,56.74 66.83,57.76 66.83,58.78 66.83,59.79 66.83,60.81 66.83,61.82 66.83,62.84 66.83,63.86 66.83,64.87 67.84,54.71 67.84,55.73 68.86,54.71 68.86,55.73 69.88,54.71 69.88,55.73 70.89,55.73 71.91,54.71 71.91,55.73 72.92,54.71 72.92,55.73 73.94,54.71 73.94,55.73 74.96,54.71 74.96,55.73 75.97,55.73 75.97,54.71 76.99,54.71 76.99,55.73 76.99,56.74 75.97,56.74 75.97,57.76 75.97,58.78 75.97,59.79 75.97,60.81 75.97,61.82 75.97,62.84 75.97,63.86 75.97,64.87 76.99,64.87 76.99,63.86 76.99,62.84 76.99,61.82 76.99,60.81 76.99,59.79 76.99,58.78 76.99,57.76 70.89,54.71 100.05,54.66 99.03,54.66 98.02,54.66 97,54.66 95.99,54.66 94.97,54.66 93.95,54.66 92.94,54.66 91.92,54.66 90.91,54.66 89.89,54.66 88.87,54.66 88.87,55.68 88.87,56.69 88.87,57.71 88.87,58.72 88.87,59.74 88.87,60.76 88.87,61.77 88.87,62.79 88.87,63.8 88.87,64.82 88.87,65.84 100.05,55.68 99.03,55.68 98.02,55.68 97,55.68 95.99,55.68 94.97,55.68 93.95,55.68 92.94,55.68 91.92,55.68 90.91,55.68 89.89,55.68 100.05,56.69 99.03,56.69 100.05,57.71 99.03,57.71 100.05,58.72 99.03,58.72 99.03,59.74 100.05,60.76 99.03,60.76 100.05,61.77 99.03,61.77 100.05,62.79 99.03,62.79 100.05,63.8 99.03,63.8 99.03,64.82 100.05,64.82 100.05,65.84 99.03,65.84 98.02,65.84 98.02,64.82 97,64.82 95.99,64.82 94.97,64.82 93.95,64.82 92.94,64.82 91.92,64.82 90.91,64.82 89.89,64.82 89.89,65.84 90.91,65.84 91.92,65.84 92.94,65.84 93.95,65.84 94.97,65.84 95.99,65.84 97,65.84 100.05,59.74 122.91,77.47 121.89,77.47 120.88,77.47 119.86,77.47 118.85,77.47 117.83,77.47 116.81,77.47 115.8,77.47 114.78,77.47 113.77,77.47 112.75,77.47 111.73,77.47 111.73,78.49 111.73,79.5 111.73,80.52 111.73,81.53 111.73,82.55 111.73,83.57 111.73,84.58 111.73,85.6 111.73,86.61 111.73,87.63 111.73,88.65 122.91,78.49 121.89,78.49 120.88,78.49 119.86,78.49 118.85,78.49 117.83,78.49 116.81,78.49 115.8,78.49 114.78,78.49 113.77,78.49 112.75,78.49 122.91,79.5 121.89,79.5 122.91,80.52 121.89,80.52 122.91,81.53 121.89,81.53 121.89,82.55 122.91,83.57 121.89,83.57 122.91,84.58 121.89,84.58 122.91,85.6 121.89,85.6 122.91,86.61 121.89,86.61 121.89,87.63 122.91,87.63 122.91,88.65 121.89,88.65 120.88,88.65 120.88,87.63 119.86,87.63 118.85,87.63 117.83,87.63 116.81,87.63 115.8,87.63 114.78,87.63 113.77,87.63 112.75,87.63 112.75,88.65 113.77,88.65 114.78,88.65 115.8,88.65 116.81,88.65 117.83,88.65 118.85,88.65 119.86,88.65 122.91,82.55 42.95,66.09 43.97,66.09 44.98,66.09 46,66.09 47.02,66.09 48.03,66.09 49.05,66.09 50.06,66.09 51.08,66.09 52.1,66.09 53.11,66.09 54.13,66.09 54.13,65.07 54.13,64.06 54.13,63.04 54.13,62.03 54.13,61.01 54.13,59.99 54.13,58.98 54.13,57.96 54.13,56.95 54.13,55.93 54.13,54.91 42.95,65.07 43.97,65.07 44.98,65.07 46,65.07 47.02,65.07 48.03,65.07 49.05,65.07 50.06,65.07 51.08,65.07 52.1,65.07 53.11,65.07 42.95,64.06 43.97,64.06 42.95,63.04 43.97,63.04 42.95,62.03 43.97,62.03 43.97,61.01 42.95,59.99 43.97,59.99 42.95,58.98 43.97,58.98 42.95,57.96 43.97,57.96 42.95,56.95 43.97,56.95 43.97,55.93 42.95,55.93 42.95,54.91 43.97,54.91 44.98,54.91 44.98,55.93 46,55.93 47.02,55.93 48.03,55.93 49.05,55.93 50.06,55.93 51.08,55.93 52.1,55.93 53.11,55.93 53.11,54.91 52.1,54.91 51.08,54.91 50.06,54.91 49.05,54.91 48.03,54.91 47.02,54.91 46,54.91 42.95,61.01 31.47,65.63 31.47,64.62 31.47,63.6 31.47,62.59 31.47,61.57 31.47,60.55 31.47,59.54 31.47,58.52 31.47,57.51 31.47,56.49 31.47,55.47 31.47,54.46 30.45,54.46 29.44,54.46 28.42,54.46 27.41,54.46 26.39,54.46 25.37,54.46 24.36,54.46 23.34,54.46 22.33,54.46 21.31,54.46 20.29,54.46 30.45,65.63 30.45,64.62 30.45,63.6 30.45,62.59 30.45,61.57 30.45,60.55 30.45,59.54 30.45,58.52 30.45,57.51 30.45,56.49 30.45,55.47 29.44,65.63 29.44,64.62 28.42,65.63 28.42,64.62 27.41,65.63 27.41,64.62 26.39,64.62 25.37,65.63 25.37,64.62 24.36,65.63 24.36,64.62 23.34,65.63 23.34,64.62 22.33,65.63 22.33,64.62 21.31,64.62 21.31,65.63 20.29,65.63 20.29,64.62 20.29,63.6 21.31,63.6 21.31,62.59 21.31,61.57 21.31,60.55 21.31,59.54 21.31,58.52 21.31,57.51 21.31,56.49 21.31,55.47 20.29,55.47 20.29,56.49 20.29,57.51 20.29,58.52 20.29,59.54 20.29,60.55 20.29,61.57 20.29,62.59 26.39,65.63 130.18,81.64 130.18,80.62 131.19,80.62 131.19,81.64 131.19,79.6 130.18,79.6 130.18,77.57 130.18,78.59 130.18,76.56 130.18,75.54 130.18,74.52 130.18,62.33 130.18,63.35 130.18,64.36 130.18,65.38 130.18,66.4 130.18,67.41 130.18,68.43 130.18,69.44 130.18,70.46 130.18,71.48 130.18,72.49 130.18,73.51 132.21,81.64 133.22,81.64 134.24,81.64 135.25,81.64 136.27,81.64 137.29,81.64 138.3,81.64 139.32,81.64 140.34,81.64 141.35,81.64 141.35,80.62 140.34,80.62 139.32,80.62 138.3,80.62 137.29,80.62 136.27,80.62 135.25,80.62 134.24,80.62 133.22,80.62 132.21,80.62 132.21,79.6 141.35,79.6 141.35,78.59 141.35,77.57 141.35,76.56 141.35,75.54 141.35,74.52 141.35,73.51 141.35,72.49 141.35,71.48 141.35,70.46 141.35,69.44 141.35,68.43 141.35,67.41 141.35,66.4 141.35,65.38 141.35,64.36 141.35,63.35 141.35,62.33 140.34,62.33 139.32,62.33 138.3,62.33 137.29,62.33 136.27,62.33 135.25,62.33 134.24,62.33 133.22,62.33 132.21,62.33 131.19,62.33 131.19,63.35 131.19,64.36 131.19,65.38 131.19,66.4 131.19,67.41 131.19,68.43 131.19,69.44 131.19,70.46 131.19,71.48 131.19,72.49 131.19,73.51 131.19,74.52 131.19,75.54 131.19,76.56 131.19,77.57 131.19,78.59 132.21,78.59 132.21,77.57 132.21,76.56 132.21,75.54 132.21,74.52 132.21,73.51 132.21,72.49 132.21,71.48 132.21,70.46 132.21,69.44 132.21,68.43 132.21,67.41 132.21,66.4 132.21,65.38 132.21,64.36 132.21,63.35 133.22,63.35 134.24,63.35 135.25,63.35 136.27,63.35 137.29,63.35 138.3,63.35 139.32,63.35 140.34,63.35 133.22,64.36 133.22,65.38 133.22,66.4 133.22,67.41 133.22,68.43 133.22,69.44 133.22,70.46 133.22,71.48 133.22,72.49 133.22,73.51 133.22,74.52 133.22,75.54 133.22,76.56 133.22,77.57 133.22,78.59 133.22,79.6 140.34,79.6 140.34,78.59 140.34,77.57 140.34,76.56 140.34,75.54 140.34,74.52 140.34,73.51 140.34,72.49 140.34,71.48 140.34,70.46 140.34,69.44 140.34,68.43 140.34,67.41 140.34,66.4 140.34,65.38 140.34,64.36 13.21,62.2 13.21,63.22 12.19,63.22 12.19,62.2 12.19,64.24 13.21,64.24 13.21,66.27 13.21,65.25 13.21,67.28 13.21,68.3 13.21,69.32 13.21,81.51 13.21,80.49 13.21,79.48 13.21,78.46 13.21,77.44 13.21,76.43 13.21,75.41 13.21,74.4 13.21,73.38 13.21,72.36 13.21,71.35 13.21,70.33 11.18,62.2 10.16,62.2 9.14,62.2 8.13,62.2 7.11,62.2 6.1,62.2 5.08,62.2 4.06,62.2 3.05,62.2 2.03,62.2 2.03,63.22 3.05,63.22 4.06,63.22 5.08,63.22 6.1,63.22 7.11,63.22 8.13,63.22 9.14,63.22 10.16,63.22 11.18,63.22 11.18,64.24 2.03,64.24 2.03,65.25 2.03,66.27 2.03,67.28 2.03,68.3 2.03,69.32 2.03,70.33 2.03,71.35 2.03,72.36 2.03,73.38 2.03,74.4 2.03,75.41 2.03,76.43 2.03,77.44 2.03,78.46 2.03,79.48 2.03,80.49 2.03,81.51 3.05,81.51 4.06,81.51 5.08,81.51 6.1,81.51 7.11,81.51 8.13,81.51 9.14,81.51 10.16,81.51 11.18,81.51 12.19,81.51 12.19,80.49 12.19,79.48 12.19,78.46 12.19,77.44 12.19,76.43 12.19,75.41 12.19,74.4 12.19,73.38 12.19,72.36 12.19,71.35 12.19,70.33 12.19,69.32 12.19,68.3 12.19,67.28 12.19,66.27 12.19,65.25 11.18,65.25 11.18,66.27 11.18,67.28 11.18,68.3 11.18,69.32 11.18,70.33 11.18,71.35 11.18,72.36 11.18,73.38 11.18,74.4 11.18,75.41 11.18,76.43 11.18,77.44 11.18,78.46 11.18,79.48 11.18,80.49 10.16,80.49 9.14,80.49 8.13,80.49 7.11,80.49 6.1,80.49 5.08,80.49 4.06,80.49 3.05,80.49 10.16,79.48 10.16,78.46 10.16,77.44 10.16,76.43 10.16,75.41 10.16,74.4 10.16,73.38 10.16,72.36 10.16,71.35 10.16,70.33 10.16,69.32 10.16,68.3 10.16,67.28 10.16,66.27 10.16,65.25 10.16,64.24 3.05,64.24 3.05,65.25 3.05,66.27 3.05,67.28 3.05,68.3 3.05,69.32 3.05,70.33 3.05,71.35 3.05,72.36 3.05,73.38 3.05,74.4 3.05,75.41 3.05,76.43 3.05,77.44 3.05,78.46 3.05,79.48
  pour Top (isolate 0.61, no thermals): -1.4,98.4 -0.25,48.87 105.16,48.87 109.22,49 133.99,48.87 134.37,51.28 143.48,51.21 143.38,98.4
  pour InsideTop (isolate 0.406, no thermals): -0.25,99.03 145.03,99.03 arc-90 147.57,96.49 147.57,49.12 1.14,49.12 arc-90 -1.4,51.66
  pour InsideBot (isolate 0.406, no thermals): -0.25,97.51 140.46,97.51 arc-90 143,94.97 143,48.87 -0.13,48.87 arc-90 -0.89,49.63 -0.89,97.38
  pour Bottom (isolate 0.813, no thermals): -0.76,83.41 15.49,83.41 15.87,83.03 15.87,61.06 15.49,60.68 -1.14,60.68 -1.52,61.06
  pour Bottom (isolate 0.813, no thermals): 144.78,60.81 128.52,60.81 128.14,61.19 128.14,83.16 128.52,83.54 145.16,83.54 145.54,83.16
7.4VSCALED  (via drill 0.5, 0.6)
  Top 0.406: R1.1 v84.96,77.06
  Top 1.27: CON1.P$7 137.36,51.87 141.46,51.9 140.16,51.9
  Bottom 0.254: 141.46,51.95 140.28,51.95 CON1.P$7
  Bottom 0.356: 130.77,55.27 133.17,54.04
  Bottom 0.406: v84.96,77.06 89.15,72.87 99.31,72.87 102.74,76.3 108.2,76.3 114.81,71.22 121.03,71.22 125.6,66.9 125.6,56.11 126.49,56.11 129.26,55.73 130.77,55.27 | 133.17,54.04 133.75,53.54 135.91,52.02 136.91,52.02 138.09,52.02 v136.84,52.02
  Bottom 1.27: 136.91,52.02 141.46,52.02 141.46,51.95
+7.4VPOWER  (via drill 0.5, 0.6)
  Top 0.254: v136.53,49.86 v138.07,49.83
  Top 0.406: v67.31,49.25 67.44,49 67.18,49.25 65.95,47.47 PTC1.2 64.73,46.67 v66.29,45.06 | 5.37,39.88 v5.46,41.5
  Top 1.27: CON2.P$1 5.37,39.88 | CON1.P$6 141.96,49.89 v136.53,49.86
  Bottom 0.356: 124.97,54.58 129.41,54.58 132.16,53.12 132.41,52.77
  Bottom 0.406: v67.31,49.25 69.34,50.01 74.04,50.01 75.06,50.77 79.5,55.22 86.36,55.22 91.57,49.89 97.16,49.89 103.25,55.98 108.59,55.98 114.17,50.39 120.78,50.39 124.97,54.58 | v5.46,41.5 14.86,41.5 21.08,47.22 29.34,47.22 34.54,42.01 40.13,42.01 44.07,47.35 51.94,47.35 57.4,41.88 62.74,41.88 65.41,44.55 v66.29,45.06 | 132.41,52.77 133.03,51.97 135.61,50.5 135.61,50.44
  Bottom 1.27: 135.61,50.5 136.42,49.89 CON1.P$6
AGND  (via drill 0.5, 0.6)
  Top 0.305: NTC2.2 77.88,50.06 arc-45 77.57,50.37 v76.84,51.03 | NTC3.2 110.92,50.11 arc45 110.95,49.78 v112.29,50.01
  Top 0.406: NTC1.2 32.46,50.87 arc-45 32.28,51.05 v32.13,51.16 | v120.78,49.25 123.57,49.28 125.75,46.41 128.02,46.41 129.18,47.73 129.77,47.76 135.22,47.76 136.58,45.86 v136.58,45.92 136.61,45.88
  Top 1.27: v136.58,45.92 141.41,45.92 141.41,45.85
  Bottom 0.305: 120.8,49.63 arc45 120.85,49.45
  Bottom 0.356: 113.08,50.32 112.37,51.18 | 66.42,50.14 66.17,49.89 | 67.94,48.11 68.15,48.31 | 97.54,49 97.61,49.07
  Bottom 0.406: 68.15,48.31 70.99,48.87 74.44,49.12 arc45 75.26,49.45 v76.84,51.03 79.88,54.33 85.85,54.33 91.19,49 97.54,49 | 97.61,49.07 103.5,55.22 108.33,55.22 112.37,51.18 113.92,49.63 120.8,49.63 | 120.85,49.45 120.72,49.45 v120.78,49.25 | 113.08,50.32 v112.29,50.01 | v32.13,51.16 32.08,52.25 34.93,55.09 40.54,55.09 42.62,52.99 45.97,49.63 52.22,49.63 52.27,49.96 57.02,54.71 63.37,54.71 66.42,51.66 66.42,50.14 | 66.17,49.89 66.17,48.62 66.68,48.11 67.94,48.11
  Bottom 1.27: CON1.P$4 141.11,45.87 141.11,45.85 136.58,45.85 | 136.51,45.85 136.58,45.85 | 136.58,45.85 v136.58,45.92
FAN  (via drill 0.5, 0.6)
  Top 1.016: CON1.P$9 142.01,55.87 142.01,55.95 138.76,55.95
  Top 1.27: CON2.P$6 5.01,49.87 5.01,50 4.45,50 v4.59,49.94
  Bottom 0.254: CON1.P$9 140.21,55.87 140.21,55.98
  Bottom 0.356: 16.26,87.73 22.35,94.08 28.57,94.08 34.54,88.11 39.62,88.11 43.69,92.18 53.34,92.18 57.15,88.37 63.25,88.37 68.58,93.7 75.06,93.7 80.77,87.99 85.22,87.99 90.93,93.7 98.04,93.7 103.63,88.11 108.33,88.11 113.28,93.07 121.16,93.07 127.13,87.1
  Bottom 0.406: v4.59,49.94 6.35,53.44 9.02,55.47 12.7,55.47 16.26,59.03 16.26,87.73 | 127.13,87.1 127.13,58.65 136.37,56.36 137.34,56.36 v137.74,55.98
  Bottom 1.016: v137.74,55.98 140.21,55.98 141.46,55.98 139.76,55.95
GND  (via drill 0.36, 0.5, 0.6)
  Top 0.406: 6.07,55.88 6.48,55.47 v8.73,52.33
  Top 1.27: CON2.P$9 6.07,55.88
  Bottom 0.406: v8.73,52.33 v8.64,46.96
  other vias: 20.35,42.82 21.36,42.82 22.38,42.82 23.39,42.82 24.41,42.82 25.43,42.82 26.44,42.82 27.46,42.82 28.47,42.82 29.49,42.82 30.51,42.82 31.52,42.82 31.52,41.81 31.52,40.79 31.52,39.78 31.52,38.76 31.52,37.74 31.52,36.73 31.52,35.71 31.52,34.7 31.52,33.68 31.52,32.66 31.52,31.65 20.35,41.81 21.36,41.81 22.38,41.81 23.39,41.81 24.41,41.81 25.43,41.81 26.44,41.81 27.46,41.81 28.47,41.81 29.49,41.81 30.51,41.81 20.35,40.79 21.36,40.79 20.35,39.78 21.36,39.78 20.35,38.76 21.36,38.76 21.36,37.74 20.35,36.73 21.36,36.73 20.35,35.71 21.36,35.71 20.35,34.7 21.36,34.7 20.35,33.68 21.36,33.68 21.36,32.66 20.35,32.66 20.35,31.65 21.36,31.65 22.38,31.65 22.38,32.66 23.39,32.66 24.41,32.66 25.43,32.66 26.44,32.66 27.46,32.66 28.47,32.66 29.49,32.66 30.51,32.66 30.51,31.65 29.49,31.65 28.47,31.65 27.46,31.65 26.44,31.65 25.43,31.65 24.41,31.65 23.39,31.65 20.35,37.74 76.99,31.9 75.97,31.9 74.96,31.9 73.94,31.9 72.92,31.9 71.91,31.9 70.89,31.9 69.88,31.9 68.86,31.9 67.84,31.9 66.83,31.9 65.81,31.9 65.81,32.92 65.81,33.93 65.81,34.95 65.81,35.97 65.81,36.98 65.81,38 65.81,39.01 65.81,40.03 65.81,41.05 65.81,42.06 65.81,43.08 76.99,32.92 75.97,32.92 74.96,32.92 73.94,32.92 72.92,32.92 71.91,32.92 70.89,32.92 69.88,32.92 68.86,32.92 67.84,32.92 66.83,32.92 76.99,33.93 75.97,33.93 76.99,34.95 75.97,34.95 76.99,35.97 75.97,35.97 75.97,36.98 76.99,38 75.97,38 76.99,39.01 75.97,39.01 76.99,40.03 75.97,40.03 76.99,41.05 75.97,41.05 75.97,42.06 76.99,42.06 76.99,43.08 75.97,43.08 74.96,43.08 74.96,42.06 73.94,42.06 72.92,42.06 71.91,42.06 70.89,42.06 69.88,42.06 68.86,42.06 67.84,42.06 66.83,42.06 66.83,43.08 67.84,43.08 68.86,43.08 69.88,43.08 70.89,43.08 71.91,43.08 72.92,43.08 73.94,43.08 76.99,36.98 99.95,42.88 99.95,41.86 99.95,40.84 99.95,39.83 99.95,38.81 99.95,37.8 99.95,36.78 99.95,35.76 99.95,34.75 99.95,33.73 99.95,32.72 99.95,31.7 98.93,31.7 97.92,31.7 96.9,31.7 95.89,31.7 94.87,31.7 93.85,31.7 92.84,31.7 91.82,31.7 90.81,31.7 89.79,31.7 88.77,31.7 98.93,42.88 98.93,41.86 98.93,40.84 98.93,39.83 98.93,38.81 98.93,37.8 98.93,36.78 98.93,35.76 98.93,34.75 98.93,33.73 98.93,32.72 97.92,42.88 97.92,41.86 96.9,42.88 96.9,41.86 95.89,42.88 95.89,41.86 94.87,41.86 93.85,42.88 93.85,41.86 92.84,42.88 92.84,41.86 91.82,42.88 91.82,41.86 90.81,42.88 90.81,41.86 89.79,41.86 89.79,42.88 88.77,42.88 88.77,41.86 88.77,40.84 89.79,40.84 89.79,39.83 89.79,38.81 89.79,37.8 89.79,36.78 89.79,35.76 89.79,34.75 89.79,33.73 89.79,32.72 88.77,32.72 88.77,33.73 88.77,34.75 88.77,35.76 88.77,36.78 88.77,37.8 88.77,38.81 88.77,39.83 94.87,42.88 111.73,42.77 112.75,42.77 113.77,42.77 114.78,42.77 115.8,42.77 116.81,42.77 117.83,42.77 118.85,42.77 119.86,42.77 120.88,42.77 121.89,42.77 122.91,42.77 122.91,41.76 122.91,40.74 122.91,39.73 122.91,38.71 122.91,37.69 122.91,36.68 122.91,35.66 122.91,34.65 122.91,33.63 122.91,32.61 122.91,31.6 111.73,41.76 112.75,41.76 113.77,41.76 114.78,41.76 115.8,41.76 116.81,41.76 117.83,41.76 118.85,41.76 119.86,41.76 120.88,41.76 121.89,41.76 111.73,40.74 112.75,40.74 111.73,39.73 112.75,39.73 111.73,38.71 112.75,38.71 112.75,37.69 111.73,36.68 112.75,36.68 111.73,35.66 112.75,35.66 111.73,34.65 112.75,34.65 111.73,33.63 112.75,33.63 112.75,32.61 111.73,32.61 111.73,31.6 112.75,31.6 113.77,31.6 113.77,32.61 114.78,32.61 115.8,32.61 116.81,32.61 117.83,32.61 118.85,32.61 119.86,32.61 120.88,32.61 121.89,32.61 121.89,31.6 120.88,31.6 119.86,31.6 118.85,31.6 117.83,31.6 116.81,31.6 115.8,31.6 114.78,31.6 111.73,37.69 111.53,9.09 111.53,10.11 111.53,11.13 111.53,12.14 111.53,13.16 111.53,14.17 111.53,15.19 111.53,16.21 111.53,17.22 111.53,18.24 111.53,19.25 111.53,20.27 112.55,20.27 113.56,20.27 114.58,20.27 115.6,20.27 116.61,20.27 117.63,20.27 118.64,20.27 119.66,20.27 120.68,20.27 121.69,20.27 122.71,20.27 112.55,9.09 112.55,10.11 112.55,11.13 112.55,12.14 112.55,13.16 112.55,14.17 112.55,15.19 112.55,16.21 112.55,17.22 112.55,18.24 112.55,19.25 113.56,9.09 113.56,10.11 114.58,9.09 114.58,10.11 115.6,9.09 115.6,10.11 116.61,10.11 117.63,9.09 117.63,10.11 118.64,9.09 118.64,10.11 119.66,9.09 119.66,10.11 120.68,9.09 120.68,10.11 121.69,10.11 121.69,9.09 122.71,9.09 122.71,10.11 122.71,11.13 121.69,11.13 121.69,12.14 121.69,13.16 121.69,14.17 121.69,15.19 121.69,16.21 121.69,17.22 121.69,18.24 121.69,19.25 122.71,19.25 122.71,18.24 122.71,17.22 122.71,16.21 122.71,15.19 122.71,14.17 122.71,13.16 122.71,12.14 116.61,9.09 88.72,20.27 89.74,20.27 90.75,20.27 91.77,20.27 92.79,20.27 93.8,20.27 94.82,20.27 95.83,20.27 96.85,20.27 97.87,20.27 98.88,20.27 99.9,20.27 99.9,19.25 99.9,18.24 99.9,17.22 99.9,16.21 99.9,15.19 99.9,14.17 99.9,13.16 99.9,12.14 99.9,11.13 99.9,10.11 99.9,9.09 88.72,19.25 89.74,19.25 90.75,19.25 91.77,19.25 92.79,19.25 93.8,19.25 94.82,19.25 95.83,19.25 96.85,19.25 97.87,19.25 98.88,19.25 88.72,18.24 89.74,18.24 88.72,17.22 89.74,17.22 88.72,16.21 89.74,16.21 89.74,15.19 88.72,14.17 89.74,14.17 88.72,13.16 89.74,13.16 88.72,12.14 89.74,12.14 88.72,11.13 89.74,11.13 89.74,10.11 88.72,10.11 88.72,9.09 89.74,9.09 90.75,9.09 90.75,10.11 91.77,10.11 92.79,10.11 93.8,10.11 94.82,10.11 95.83,10.11 96.85,10.11 97.87,10.11 98.88,10.11 98.88,9.09 97.87,9.09 96.85,9.09 95.83,9.09 94.82,9.09 93.8,9.09 92.79,9.09 91.77,9.09 88.72,15.19 43.05,31.95 43.05,32.97 43.05,33.99 43.05,35 43.05,36.02 43.05,37.03 43.05,38.05 43.05,39.07 43.05,40.08 43.05,41.1 43.05,42.11 43.05,43.13 44.07,43.13 45.09,43.13 46.1,43.13 47.12,43.13 48.13,43.13 49.15,43.13 50.16,43.13 51.18,43.13 52.2,43.13 53.21,43.13 54.23,43.13 44.07,31.95 44.07,32.97 44.07,33.99 44.07,35 44.07,36.02 44.07,37.03 44.07,38.05 44.07,39.07 44.07,40.08 44.07,41.1 44.07,42.11 45.09,31.95 45.09,32.97 46.1,31.95 46.1,32.97 47.12,31.95 47.12,32.97 48.13,32.97 49.15,31.95 49.15,32.97 50.16,31.95 50.16,32.97 51.18,31.95 51.18,32.97 52.2,31.95 52.2,32.97 53.21,32.97 53.21,31.95 54.23,31.95 54.23,32.97 54.23,33.99 53.21,33.99 53.21,35 53.21,36.02 53.21,37.03 53.21,38.05 53.21,39.07 53.21,40.08 53.21,41.1 53.21,42.11 54.23,42.11 54.23,41.1 54.23,40.08 54.23,39.07 54.23,38.05 54.23,37.03 54.23,36.02 54.23,35 48.13,31.95 77.14,20.32 77.14,19.3 77.14,18.29 77.14,17.27 77.14,16.26 77.14,15.24 77.14,14.22 77.14,13.21 77.14,12.19 77.14,11.18 77.14,10.16 77.14,9.14 76.12,9.14 75.11,9.14 74.09,9.14 73.08,9.14 72.06,9.14 71.04,9.14 70.03,9.14 69.01,9.14 68,9.14 66.98,9.14 65.96,9.14 76.12,20.32 76.12,19.3 76.12,18.29 76.12,17.27 76.12,16.26 76.12,15.24 76.12,14.22 76.12,13.21 76.12,12.19 76.12,11.18 76.12,10.16 75.11,20.32 75.11,19.3 74.09,20.32 74.09,19.3 73.08,20.32 73.08,19.3 72.06,19.3 71.04,20.32 71.04,19.3 70.03,20.32 70.03,19.3 69.01,20.32 69.01,19.3 68,20.32 68,19.3 66.98,19.3 66.98,20.32 65.96,20.32 65.96,19.3 65.96,18.29 66.98,18.29 66.98,17.27 66.98,16.26 66.98,15.24 66.98,14.22 66.98,13.21 66.98,12.19 66.98,11.18 66.98,10.16 65.96,10.16 65.96,11.18 65.96,12.19 65.96,13.21 65.96,14.22 65.96,15.24 65.96,16.26 65.96,17.27 72.06,20.32 54.18,9.04 53.16,9.04 52.15,9.04 51.13,9.04 50.11,9.04 49.1,9.04 48.08,9.04 47.07,9.04 46.05,9.04 45.03,9.04 44.02,9.04 43,9.04 43,10.06 43,11.07 43,12.09 43,13.11 43,14.12 43,15.14 43,16.15 43,17.17 43,18.19 43,19.2 43,20.22 54.18,10.06 53.16,10.06 52.15,10.06 51.13,10.06 50.11,10.06 49.1,10.06 48.08,10.06 47.07,10.06 46.05,10.06 45.03,10.06 44.02,10.06 54.18,11.07 53.16,11.07 54.18,12.09 53.16,12.09 54.18,13.11 53.16,13.11 53.16,14.12 54.18,15.14 53.16,15.14 54.18,16.15 53.16,16.15 54.18,17.17 53.16,17.17 54.18,18.19 53.16,18.19 53.16,19.2 54.18,19.2 54.18,20.22 53.16,20.22 52.15,20.22 52.15,19.2 51.13,19.2 50.11,19.2 49.1,19.2 48.08,19.2 47.07,19.2 46.05,19.2 45.03,19.2 44.02,19.2 44.02,20.22 45.03,20.22 46.05,20.22 47.07,20.22 48.08,20.22 49.1,20.22 50.11,20.22 51.13,20.22 54.18,14.12 20.19,8.84 20.19,9.86 20.19,10.87 20.19,11.89 20.19,12.9 20.19,13.92 20.19,14.94 20.19,15.95 20.19,16.97 20.19,17.98 20.19,19 20.19,20.02 21.21,20.02 22.23,20.02 23.24,20.02 24.26,20.02 25.27,20.02 26.29,20.02 27.3,20.02 28.32,20.02 29.34,20.02 30.35,20.02 31.37,20.02 21.21,8.84 21.21,9.86 21.21,10.87 21.21,11.89 21.21,12.9 21.21,13.92 21.21,14.94 21.21,15.95 21.21,16.97 21.21,17.98 21.21,19 22.23,8.84 22.23,9.86 23.24,8.84 23.24,9.86 24.26,8.84 24.26,9.86 25.27,9.86 26.29,8.84 26.29,9.86 27.3,8.84 27.3,9.86 28.32,8.84 28.32,9.86 29.34,8.84 29.34,9.86 30.35,9.86 30.35,8.84 31.37,8.84 31.37,9.86 31.37,10.87 30.35,10.87 30.35,11.89 30.35,12.9 30.35,13.92 30.35,14.94 30.35,15.95 30.35,16.97 30.35,17.98 30.35,19 31.37,19 31.37,17.98 31.37,16.97 31.37,15.95 31.37,14.94 31.37,13.92 31.37,12.9 31.37,11.89 25.27,8.84 130.05,35.41 130.05,34.39 131.06,34.39 131.06,35.41 131.06,33.38 130.05,33.38 130.05,31.34 130.05,32.36 130.05,30.33 130.05,29.31 130.05,28.3 130.05,16.1 130.05,17.12 130.05,18.14 130.05,19.15 130.05,20.17 130.05,21.18 130.05,22.2 130.05,23.22 130.05,24.23 130.05,25.25 130.05,26.26 130.05,27.28 132.08,35.41 133.1,35.41 134.11,35.41 135.13,35.41 136.14,35.41 137.16,35.41 138.18,35.41 139.19,35.41 140.21,35.41 141.22,35.41 141.22,34.39 140.21,34.39 139.19,34.39 138.18,34.39 137.16,34.39 136.14,34.39 135.13,34.39 134.11,34.39 133.1,34.39 132.08,34.39 132.08,33.38 141.22,33.38 141.22,32.36 141.22,31.34 141.22,30.33 141.22,29.31 141.22,28.3 141.22,27.28 141.22,26.26 141.22,25.25 141.22,24.23 141.22,23.22 141.22,22.2 141.22,21.18 141.22,20.17 141.22,19.15 141.22,18.14 141.22,17.12 141.22,16.1 140.21,16.1 139.19,16.1 138.18,16.1 137.16,16.1 136.14,16.1 135.13,16.1 134.11,16.1 133.1,16.1 132.08,16.1 131.06,16.1 131.06,17.12 131.06,18.14 131.06,19.15 131.06,20.17 131.06,21.18 131.06,22.2 131.06,23.22 131.06,24.23 131.06,25.25 131.06,26.26 131.06,27.28 131.06,28.3 131.06,29.31 131.06,30.33 131.06,31.34 131.06,32.36 132.08,32.36 132.08,31.34 132.08,30.33 132.08,29.31 132.08,28.3 132.08,27.28 132.08,26.26 132.08,25.25 132.08,24.23 132.08,23.22 132.08,22.2 132.08,21.18 132.08,20.17 132.08,19.15 132.08,18.14 132.08,17.12 133.1,17.12 134.11,17.12 135.13,17.12 136.14,17.12 137.16,17.12 138.18,17.12 139.19,17.12 140.21,17.12 133.1,18.14 133.1,19.15 133.1,20.17 133.1,21.18 133.1,22.2 133.1,23.22 133.1,24.23 133.1,25.25 133.1,26.26 133.1,27.28 133.1,28.3 133.1,29.31 133.1,30.33 133.1,31.34 133.1,32.36 133.1,33.38 140.21,33.38 140.21,32.36 140.21,31.34 140.21,30.33 140.21,29.31 140.21,28.3 140.21,27.28 140.21,26.26 140.21,25.25 140.21,24.23 140.21,23.22 140.21,22.2 140.21,21.18 140.21,20.17 140.21,19.15 140.21,18.14 12.83,15.72 12.83,16.74 11.81,16.74 11.81,15.72 11.81,17.75 12.83,17.75 12.83,19.79 12.83,18.77 12.83,20.8 12.83,21.82 12.83,22.83 12.83,35.03 12.83,34.01 12.83,32.99 12.83,31.98 12.83,30.96 12.83,29.95 12.83,28.93 12.83,27.91 12.83,26.9 12.83,25.88 12.83,24.87 12.83,23.85 10.79,15.72 9.78,15.72 8.76,15.72 7.75,15.72 6.73,15.72 5.71,15.72 4.7,15.72 3.68,15.72 2.67,15.72 1.65,15.72 1.65,16.74 2.67,16.74 3.68,16.74 4.7,16.74 5.71,16.74 6.73,16.74 7.75,16.74 8.76,16.74 9.78,16.74 10.79,16.74 10.79,17.75 1.65,17.75 1.65,18.77 1.65,19.79 1.65,20.8 1.65,21.82 1.65,22.83 1.65,23.85 1.65,24.87 1.65,25.88 1.65,26.9 1.65,27.91 1.65,28.93 1.65,29.95 1.65,30.96 1.65,31.98 1.65,32.99 1.65,34.01 1.65,35.03 2.67,35.03 3.68,35.03 4.7,35.03 5.71,35.03 6.73,35.03 7.75,35.03 8.76,35.03 9.78,35.03 10.79,35.03 11.81,35.03 11.81,34.01 11.81,32.99 11.81,31.98 11.81,30.96 11.81,29.95 11.81,28.93 11.81,27.91 11.81,26.9 11.81,25.88 11.81,24.87 11.81,23.85 11.81,22.83 11.81,21.82 11.81,20.8 11.81,19.79 11.81,18.77 10.79,18.77 10.79,19.79 10.79,20.8 10.79,21.82 10.79,22.83 10.79,23.85 10.79,24.87 10.79,25.88 10.79,26.9 10.79,27.91 10.79,28.93 10.79,29.95 10.79,30.96 10.79,31.98 10.79,32.99 10.79,34.01 9.78,34.01 8.76,34.01 7.75,34.01 6.73,34.01 5.71,34.01 4.7,34.01 3.68,34.01 2.67,34.01 9.78,32.99 9.78,31.98 9.78,30.96 9.78,29.95 9.78,28.93 9.78,27.91 9.78,26.9 9.78,25.88 9.78,24.87 9.78,23.85 9.78,22.83 9.78,21.82 9.78,20.8 9.78,19.79 9.78,18.77 9.78,17.75 2.67,17.75 2.67,18.77 2.67,19.79 2.67,20.8 2.67,21.82 2.67,22.83 2.67,23.85 2.67,24.87 2.67,25.88 2.67,26.9 2.67,27.91 2.67,28.93 2.67,29.95 2.67,30.96 2.67,31.98 2.67,32.99 138,39.88
  pour Top (isolate 0.61, rank 2, no thermals): -0.76,48.49 143.13,48.23 143.38,-1.93 -1.4,-1.93
  pour InsideTop (isolate 0.406, rank 2, no thermals): 0,48.87 141.61,48.87 arc-90 142.88,46.58 142.75,-0.03 7.62,-0.03 arc-90 0.13,5.94
  pour InsideBot (isolate 0.406, rank 2, no thermals): 0,48.74 143.13,48.62 arc-90 143.38,48.36 arc-90 143.51,48.23 143.51,6.2 arc-90 137.29,-0.03 7.24,-0.03 arc-90 0.13,7.09 0.13,47.09 arc90 0,47.35 0,47.73 arc-90 0,47.98
  pour Bottom (isolate 0.813, no thermals): -1.27,36.8 14.99,36.8 15.37,36.42 15.37,14.45 14.99,14.07 -1.65,14.07 -2.03,14.45
  pour Bottom (isolate 0.813, no thermals): 144.4,14.33 128.14,14.33 127.76,14.71 127.76,36.68 128.14,37.06 144.78,37.06 145.16,36.68
HEAT  (via drill 0.5, 0.6)
  Top 0.254: v136.47,54.15 v136.46,54.15 136.46,53.9
  Top 1.27: CON1.P$8 141.81,53.87 141.81,53.9 136.46,53.9 | CON2.P$4 5.26,45.87 5.26,45.85 4.32,45.85 v4.77,45.9
  Bottom 0.356: 17.15,87.35 22.73,93.32 28.19,93.32 34.16,87.35 39.88,87.35 44.07,91.54 52.83,91.54 56.77,87.6 63.37,87.6 68.71,92.94 74.68,92.94 80.39,87.22 85.34,87.22 90.81,92.68 97.66,92.68 103.12,87.48 108.71,87.48 113.41,92.18 121.03,92.18 126.37,86.84
  Bottom 0.406: v4.77,45.9 4.45,45.95 7.11,52.17 9.02,54.46 12.83,54.46 17.15,58.65 17.15,87.35 | 126.37,86.84 126.37,57.51 129.61,56.87 134.66,55.22 135.05,54.84 136.3,54.33 v136.47,54.15
  Bottom 1.27: v136.47,54.15 137.11,54.15 137.11,53.95 141.11,53.95
NTC1  (via drill 0.5, 0.6)
  Top 0.305: NTC1.1 32.46,47.76 arc45 32.28,47.58
  Top 0.406: 32.28,47.58 v32,46.33
  Top 1.27: CON1.P$3 141.36,43.87 | 137.71,43.79 137.71,43.85 141.76,43.85 141.76,43.87 141.36,43.87 | 141.36,43.87 141.36,43.79 140.36,43.79
  Bottom 0.305: 39.39,42.9 arc45 39.57,42.97 | 69.11,47.35 arc45 69.29,47.42 | 77.37,47.6 arc-45 77.54,47.53 | 120.29,48.23 arc-45 120.22,48.16
  Bottom 0.356: 69.29,47.42 69.72,47.6 | 101.35,44.3 101.35,44.17 | 113.41,47.6 113.41,47.85
  Bottom 0.406: v32,46.33 34.93,42.9 39.39,42.9 | 39.57,42.97 43.43,48.23 52.2,48.23 57.66,42.77 62.38,42.77 65.55,46.1 66.55,46.2 69.11,47.35 | 69.72,47.6 77.37,47.6 | 77.54,47.53 79.76,43.41 86.36,43.41 91.19,48.23 97.41,48.23 101.35,44.3 | 120.29,48.23 113.79,48.23 113.41,47.85 | 120.22,48.16 125.73,42.65 134.52,42.65 135.66,43.79 138.15,43.79 | 101.35,44.17 103.25,42.27 108.08,42.27 113.41,47.6
  Bottom 1.27: 138.2,43.79 140.28,43.79 | 140.96,43.8 140.76,43.79 140.28,43.79 | 138.15,43.79 138.2,43.79 | 138.2,43.79 v138.2,43.74 | 140.28,43.79 CON1.P$3
NTC2  (via drill 0.5)
  Top 0.406: NTC2.1 78,47.65 v76.94,46.58
  Top 1.27: CON1.P$2 141.66,41.82 | 136.01,41.9 140.46,41.82 141.66,41.82 | 136.01,41.9 140.36,41.85 | 140.36,41.85 137.46,41.85 | 141.66,41.82 140.36,41.85 | 136.01,41.9 136.27,41.9 v136.27,41.5
  Bottom 0.356: v76.94,46.58 76.94,44.91 79.22,42.62 86.74,42.62 91.36,47.24 97.26,47.24 102.39,42.11 102.39,42.01 102.79,41.61 102.79,41.55 103.15,41.2 108.28,41.2 114.38,47.29 119.91,47.29 125.65,41.55 136.22,41.55 v136.27,41.5
  Bottom 1.27: v136.27,41.5 136.76,41.5 136.76,41.85 140.96,41.8
NTC3  (via drill 0.5)
  Top 0.356: 112.4,48.64 118.09,48.67 119.89,50.32
  Top 0.406: NTC3.1 111.37,47.72 112.4,48.64 | 119.89,50.32 124.97,50.32 126.06,51.41 127.94,51.41 130.43,48.92 134.6,48.97 v137.35,47.9
  Top 1.016: 137.85,47.9 v137.35,47.9
  Top 1.27: 140.28,47.9 137.85,47.9 | 141.94,47.9 140.28,47.9 | 140.28,47.9 CON1.P$5
  Bottom 1.016: 138.81,47.87 137.22,47.9
  Bottom 1.27: CON1.P$5 138.81,47.87 | 137.22,47.9 141.13,47.9
OPENFANBD-PIN  (via drill 0.5, 0.6)
  Top 0.254: 136.56,57.85 136.53,57.75 v136.53,57.86
  Top 1.016: CON1.P$10 136.56,57.85 137.62,57.86 142.06,57.86
  Top 1.27: CON2.P$8 4.57,53.87 v4.67,53.88
  Bottom 0.406: v4.67,53.88 8.76,56.24 8.89,56.36 12.32,56.36 15.49,59.54 15.49,88.24 21.97,94.84 28.96,94.84 34.93,88.87 39.37,88.87 43.43,92.94 53.59,92.94 57.4,89.13 62.99,89.13 68.2,94.34 75.44,94.34 81.15,88.62 84.96,88.62 91.06,94.72 98.04,94.72 103.89,88.87 107.95,88.87 112.9,93.83 121.54,93.83 128.02,87.35 128.02,59.79 136.56,58.45 136.56,57.89 136.53,57.89 | 136.27,57.89 136.53,57.89 | 136.53,57.89 v136.53,57.86
  Bottom 1.016: 141.58,57.86 v136.53,57.86

### Text on the board
tPlace: 7.4V | 7.4V | 0V | 0V
bPlace: DKblock | + | + | + | - | PE | - | -
tNames: + | + | + | + | + | + | + | + | + | + | + | + | + | + | + | + | + | + | + | + | + | + | + | + | + | + | + | + | + | + | + | + | BLOCK / MANAGER | COPYRIGHT / 2015 / Offgrid / Systems LLC | + | + | + | + | + | + | + | + | + | + | - | - | - | - | - | - | - | - | - | - | - | - | - | - | - | - | - | - | - | - | - | - | - | - | - | - | - | - | - | - | - | - | - | - | - | - | - | - | - | - | - | -
bNames: BLOCK MANAGER | DKblock / CLAMP 2S-7.4-0V / REV C
TimsDesignNotes: use 25 thou spacing (0.6mm) around all 36VDC per IPC2221 | ( this spacing requires no conformal coating) | BUSBAR: / - 1/16" thick x 3/4" wide by 1" long / - DCR = 175uohms/ft or about 15uohms / - Screws = 2 ea Brass 8-32 screw (hole size is .177in) | TIM find way to attach BM board.